# Altium schematic sheet PD_USB.SchDoc
size A4; SheetNumber: 5; SheetTotal: 5
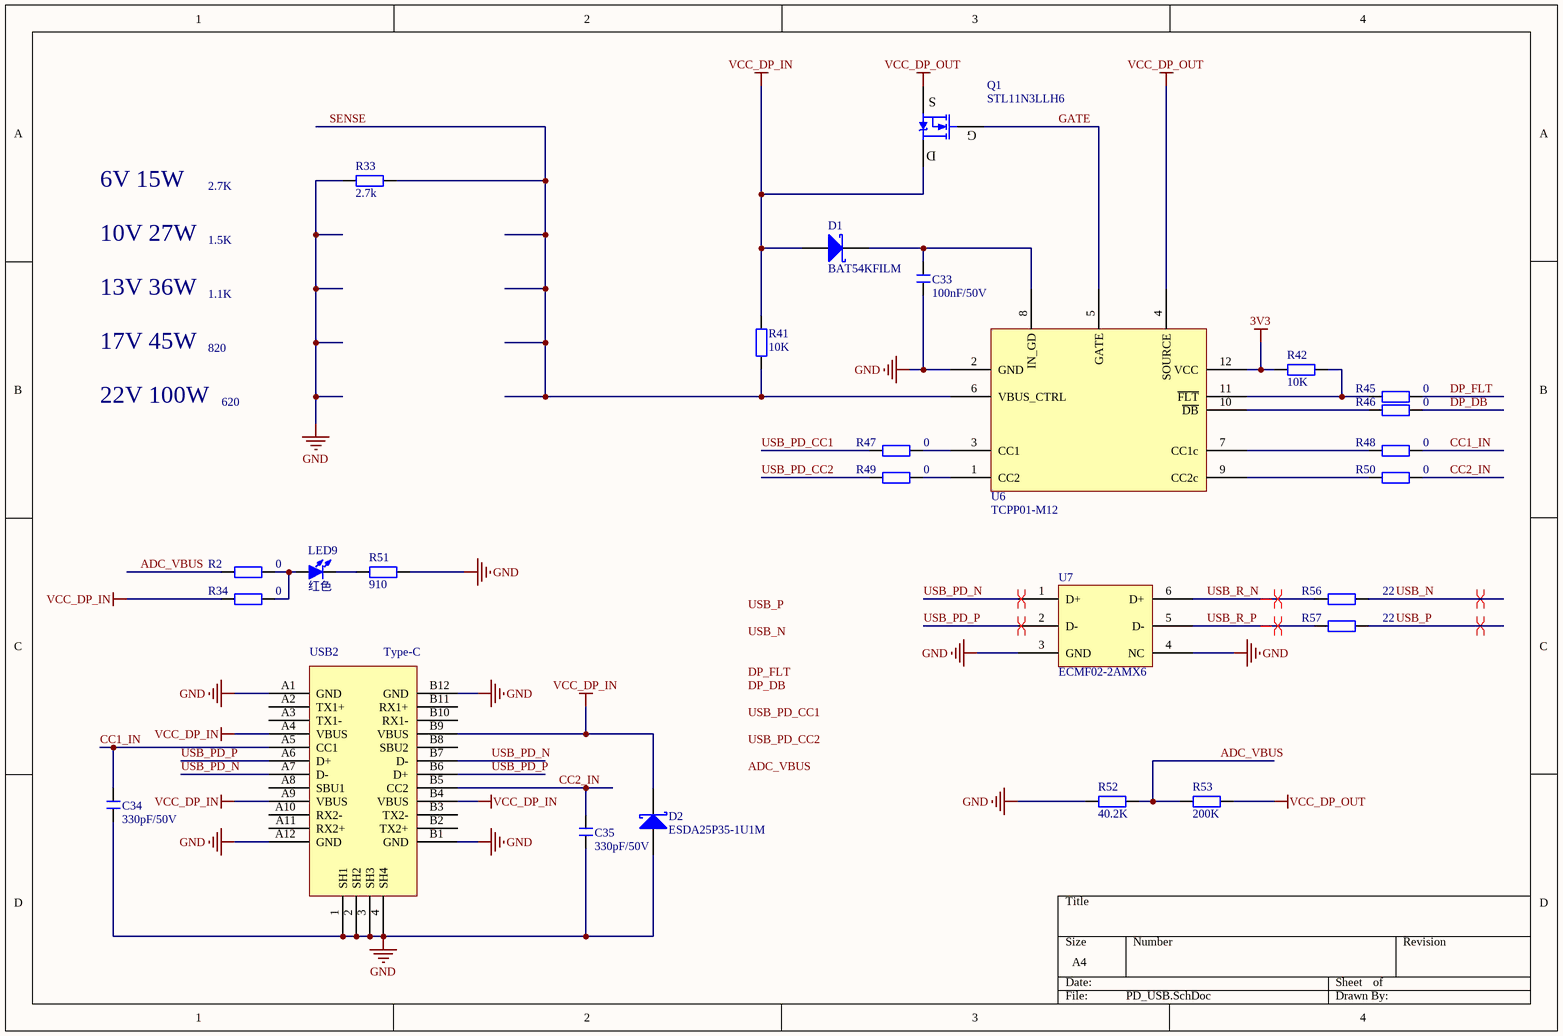
[diagram p0: PD_USB.SchDoc]

## Parts
C33  100nF/50V  [C 0402_L]
C34  330pF/50V  [C 0402_L]
C35  330pF/50V  [C 0402_L]
D1  BAT54KFILM  [BAT54KFILM]
D2  ESDA25P35-1U1M  [ESDA25P35-1U1M]
LED9  红色  [LED]
Q1  STL11N3LLH6  [STL11N3LLH6]
R2  0  [R 0402_L]
R33  2.7k  [R 0402_L]
R34  0  [R 0402_L]
R41  10K  [R 0402_L]
R42  10K  [R 0402_L]
R45  0  [R 0402_L]
R46  0  [R 0402_L]
R47  0  [R 0402_L]
R48  0  [R 0402_L]
R49  0  [R 0402_L]
R50  0  [R 0402_L]
R51  910  [R 0402_L]
R52  40.2K  [R 0402_L]
R53  200K  [R 0402_L]
R56  22  [R 0402_L]
R57  22  [R 0402_L]
U6  TCPP01-M12  [TCPP01-M12]
U7  ECMF02-2AMX6  [ECMF02-2AMX6]
USB2  Type-C  [Type-c接口]

## Nets
3V3: R42.2 U6.12(VCC)
GND: C33.1 C34.1 C35.1 D2.1(A) R33.1 R51.1 R52.2 U6.2(GND) U7.3(GND) U7.4(NC) USB2.1(SH1) USB2.2(SH2) USB2.3(SH3) USB2.4(SH4) USB2.A1(GND) USB2.A12(GND) USB2.B1(GND) USB2.B12(GND)
VCC_DP_IN: D1.1(A) D2.2(K) Q1.3(D) R34.1 R41.2 USB2.A4(VBUS) USB2.A9(VBUS) USB2.B4(VBUS) USB2.B9(VBUS)
VCC_DP_OUT: Q1.2(S) R53.1 U6.4(SOURCE)
ADC_VBUS: R2.1 R52.1 R53.2
CC1_IN: C34.2 R48.2 USB2.A5(CC1)
CC2_IN: C35.2 R50.2 USB2.B5(CC2)
DP_DB: R46.2
DP_FLT: R45.2
GATE: Q1.1(G) U6.5(GATE)
SENSE: R33.2 R41.1 U6.6(VBUS_CTRL)
USB_N: R56.1
USB_P: R57.1
USB_PD_CC1: R47.1
USB_PD_CC2: R49.1
USB_PD_N: U7.1(D+) USB2.A7(D-) USB2.B7(D-)
USB_PD_P: U7.2(D-) USB2.A6(D+) USB2.B6(D+)
USB_R_N: R56.2 U7.6(D+)
USB_R_P: R57.2 U7.5(D-)
NetC33_2: C33.2 D1.2(K) U6.8(IN_GD)
NetLED9_1: LED9.1(A) R2.2 R34.2
NetLED9_2: LED9.2(K) R51.2
NetR42_1: R42.1 R45.1 U6.11(~{FLT})
NetR46_1: R46.1 U6.10(~{DB})
NetR47_2: R47.2 U6.3(CC1)
NetR48_1: R48.1 U6.7(CC1c)
NetR49_2: R49.2 U6.1(CC2)
NetR50_1: R50.1 U6.9(CC2c)

Not connected (* = marked no-connect by the designer): USB2 A2(TX1+) A3(TX1-) A8(SBU1) A10(RX2-) A11(RX2+) B2(TX2+) B3(TX2-) B8(SBU2) B10(RX1-) B11(RX1+)

## Layout directives
differential pair: USB_N, USB_P, USB_PD_N, USB_PD_P, USB_R_N, USB_R_P

## Notes on the sheet
- 6V 15W
- 10V 27W
- 2.7K
- 1.5K
- 13V 36W
- 1.1K
- 17V 45W
- 820
- 22V 100W
- 620
- Labels drawn without touching a wire or pin: ADC_VBUS, DP_DB, DP_FLT, USB_N, USB_P, USB_PD_CC1, USB_PD_CC2

## Library data of the parts
C33 = C: 贴片电容; 主类型: 电容; 值精度: ±10%; 元件封装: 0603; 具体类型: 陶瓷电容; 封装类型: 贴片; 温度漂移: X7R（15%）; 温度范围: -55°C ~ 125°C; 生产商: SAMSUNG(三星); 生产商零件编码: CL10B104KB8NNNC; 值/型号: 100nF/50V; 立创编号: C1590
C34 C35 = C: 贴片电容; 主类型: 电容; 值精度: ±10%; 元件封装: 0402; 具体类型: 陶瓷电容; 封装类型: 贴片; 温度漂移: X7R（15%）; 温度范围: -55°C ~ 125°C; 生产商: YAGEO(国巨); 生产商零件编码: CC0402KRX7R9BB331; 值/型号: 330pF/50V; 立创编号: C106206
D1 = D Schottky: Schottky Diode; 主类型: 二极管; 元件封装: SOD-523; 具体类型: 肖特基二极管; 封装类型: 贴片; 生产商: ST(意法半导体); 值/型号: BAT54KFILM; 生产商零件编码: BAT54KFILM; 立创编号: C283259
D2 = D Schottky: Schottky Diode
LED9 = LED-SMD: C84267
Q1 = SI2302: N沟道场效应管
R2 R33 R34 R45-R50 R52 R53 = R: 贴片电阻; 元件封装: 0402; 封装类型: 贴片
R41 R42 R56 R57 = R: 贴片电阻
R51 = R: 贴片电阻 0402 5%; 主类型: 电阻; 值/型号: 15K; 值精度: ±1%; 元件封装: 0402; 封装类型: 贴片; 温度漂移: 50ppm; 生产商: 国巨; 生产商零件编码: RT0402FRE0715KL; 具体类型: 贴片电阻; 立创编号: C136975
USB2 = USB-Type-C-TOP